# EAGLE schematic Current Sense (EAGLE 6.2)
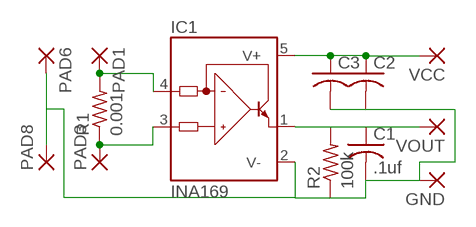
[diagram p0: schematic, sheet 1]

## Parts
C1  .1uf  C-USC0805K  [C0805K]
C2  C-USC0805K  [C0805K]
C3  C-USC0805K  [C0805K]
GND  SMD2  [SMD1,27-2,54]
IC1  INA169  INA138  [SOT23-5]
PAD1  SMD5  [SMD2,54-5,08]
PAD3  SMD5  [SMD2,54-5,08]
PAD6  SMD5  [SMD2,54-5,08]
PAD8  SMD5  [SMD2,54-5,08]
R1  0.001  R-US_R2512  [R2512]
R2  100k  R-US_R0805  [R0805]
VCC  SMD2  [SMD1,27-2,54]
VOUT  SMD2  [SMD1,27-2,54]

## Nets
IN: IC1.3(IN+) PAD3.1(P) R1.1
N$4: C1.2 C2.2 C3.2 GND.1(P) IC1.2(V-) PAD6.1(P) PAD8.1(P) R2.1
N$5: C1.1 IC1.1(OUT) R2.2 VOUT.1(P)
N$6: C2.1 C3.1 IC1.5(V+) VCC.1(P)
OUT: IC1.4(IN-) PAD1.1(P) R1.2

## Library data of the parts
C1-C3 = adafruit:C-US: CAPACITOR, American symbol
GND VCC VOUT = wirepad:SMD2: SMD PAD
IC1 = burr-brown:INA138: High-Side Measurement Current Shunt Monitor; MF: TEXAS INSTRUMENTS; MPN: INA138NA/250; OC_FARNELL: 1564888; OC_NEWARK: 80K5906
PAD1 PAD3 PAD6 PAD8 = wirepad:SMD5: SMD PAD
R1 R2 = adafruit:R-US_: RESISTOR, American symbol